# EAGLE design teensyAudioXbee_v11 (EAGLE 7.6.0)
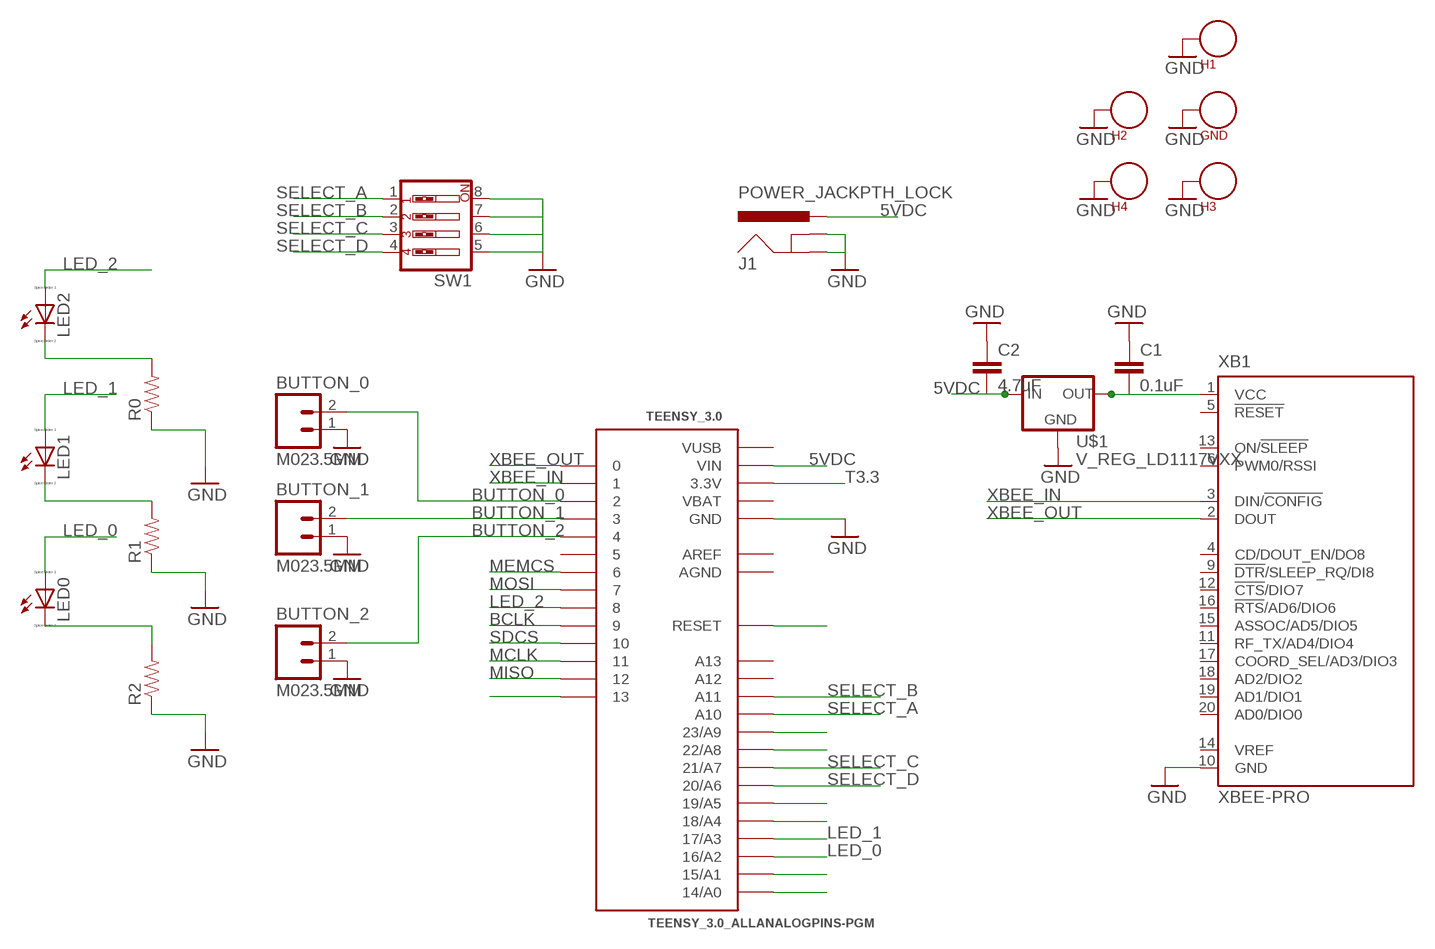
[diagram p0: schematic, sheet 1]

## Parts
BUTTON_0  M023.5MM  [SCREWTERMINAL-3.5MM-2]
BUTTON_1  M023.5MM  [SCREWTERMINAL-3.5MM-2]
BUTTON_2  M023.5MM  [SCREWTERMINAL-3.5MM-2]
C1  0.1uF  CAPEZ  [CAP-PTH-SMALLEZ]
C2  4.7uF  CAPEZ  [CAP-PTH-SMALLEZ]
GND  SEW_HOLE  [SIMPLE_HOLE]
H1  SEW_HOLE  [SIMPLE_HOLE]
H2  SEW_HOLE  [SIMPLE_HOLE]
H3  SEW_HOLE  [SIMPLE_HOLE]
H4  SEW_HOLE  [SIMPLE_HOLE]
J1  POWER_JACKPTH_LOCK  [POWER_JACK_PTH_LOCK]
LED0  LED_ELD260  [LED_LD260]
LED1  LED_ELD260  [LED_LD260]
LED2  LED_ELD260  [LED_LD260]
R0  RESISTORPTH-1/6W  [1/6W-RES]
R1  RESISTORPTH-1/6W  [1/6W-RES]
R2  RESISTORPTH-1/6W  [1/6W-RES]
SW1  SW_DIP-4  [EDG-04]
TEENSY_3.0  TEENSY_3.0_ALLANALOGPINS-PGM  [TEENSY_3.0_ALLANALOG-PGM]
U$1  V_REG_LD1117VXX  [78XXL]
XB1  XBEE-PRO  [XBEE-PRO]

## Nets
3.3VDC: C1.2 U$1.GND(OUT) XB1.1(VCC)
5VDC [5v]: C2.2 J1.PWR TEENSY_3.0.VIN U$1.OUT(IN)
BCLK: TEENSY_3.0.9
BUTTON_0: BUTTON_0.2 TEENSY_3.0.2
BUTTON_1: BUTTON_1.2 TEENSY_3.0.3
BUTTON_2: BUTTON_2.2 TEENSY_3.0.4
GND [gnd11]: BUTTON_0.1 BUTTON_1.1 BUTTON_2.1 C1.1 C2.1 GND.P$1 H1.P$1 H2.P$1 H3.P$1 H4.P$1 J1.GND J1.GNDBREAK R0.1 R1.1 R2.1 SW1.5 SW1.6 SW1.7 SW1.8 TEENSY_3.0.GND TEENSY_3.0.GND1(GND) TEENSY_3.0.GND2(GND) U$1.IN(GND) XB1.10(GND)
LED_0: LED0.A TEENSY_3.0.16/A2
LED_1: LED1.A TEENSY_3.0.17/A3
LED_2: LED2.A TEENSY_3.0.8
MCLK: TEENSY_3.0.11
MEMCS: TEENSY_3.0.6
MISO: TEENSY_3.0.12
MOSI: TEENSY_3.0.7
N$1: TEENSY_3.0.13
N$2: TEENSY_3.0.14/A0
N$3: TEENSY_3.0.15/A1
N$4: TEENSY_3.0.18/A4
N$5: TEENSY_3.0.19/A5
N$6: TEENSY_3.0.RST(RESET)
N$7: TEENSY_3.0.22/A8
N$8: TEENSY_3.0.23/A9
N$9: LED2.K(C) R0.2
N$10: LED1.K(C) R1.2
N$11: LED0.K(C) R2.2
SDCS: TEENSY_3.0.10
SELECT_A: SW1.1 TEENSY_3.0.A10
SELECT_B: SW1.2 TEENSY_3.0.A11
SELECT_C: SW1.3 TEENSY_3.0.21/A7
SELECT_D: SW1.4 TEENSY_3.0.20/A6
T3.3: TEENSY_3.0.3.3V TEENSY_3.0.3.3V1(3.3V) TEENSY_3.0.3.3V2(3.3V)
XBEE_IN: TEENSY_3.0.1 XB1.3(DIN/!CONFIG)
XBEE_OUT: TEENSY_3.0.0 XB1.2(DOUT)
Unconnected: TEENSY_3.0.5 TEENSY_3.0.A12 TEENSY_3.0.A13 XB1.4(CD/DOUT_EN/DO8) XB1.5(!RESET) XB1.6(PWM0/RSSI) XB1.9(!DTR!/SLEEP_RQ/DI8) XB1.11(RF_TX/AD4/DIO4) XB1.12(!CTS!/DIO7) XB1.13(ON/!SLEEP) XB1.14(VREF) XB1.15(ASSOC/AD5/DIO5) XB1.16(!RTS!/AD6/DIO6) XB1.17(COORD_SEL/AD3/DIO3) XB1.18(AD2/DIO2) XB1.19(AD1/DIO1) XB1.20(AD0/DIO0)

## Power pins joined to a net without a drawn wire
AGND: TEENSY_3.0.AGND
AREF: TEENSY_3.0.AREF
VBAT: TEENSY_3.0.VBAT
VUSB: TEENSY_3.0.VUSB

## Library data of the parts
BUTTON_0 BUTTON_1 BUTTON_2 = SparkFun-Connectors:M02: Standard 2-pin 0.1" header. Use with - straight break away headers ( PRT-00116) - right angle break away headers (PRT-00553) - swiss pins (PRT-00743) - machine pins (PRT-00117) - female headers (PRT-00115) Molex polarized connector foot print use with: PRT-08233 with associated crimp pins and housings. 2.54_SCREWTERM for use with PRT-10571. 3.5mm Screw Terminal footprints for PRT-08084 5mm Screw Terminal footprints for use with PRT-08433
C1 C2 = SparkFun-Capacitors:CAP: Capacitor Standard 0603 ceramic capacitor, and 0.1" leaded capacitor.
GND H1-H4 = LilyPad-Wearables:SEW_HOLE: Simple sew-hole .1" diameter hole with 20mil annular ring
J1 = SparkFun-Connectors:POWER_JACK: Power Jack This is the standard 5.5mm barrel jack for power. The PTH is the most common, proven, reliable, footprint. The Slot footprint only works if the mill layer is transmitted to the PCB fab house so be warned. Mating wall wart : TOL-00298 (and others); PROD_ID: CONN-08197; SF_ID: PRT-00119
LED0 LED1 LED2 = eagle-ltspice:LED_E: LED Source: http://www.osram.convergy.de Source: www.luxeon.com Source: www.kingbright.com; SPICEMODEL: NONE; SPICEPREFIX: D; SPICETYPE: diode
R0 R1 R2 = SparkFun-Passives:RESISTOR: Resistor Basic schematic elements and footprints for 0603, 1206, and PTH resistors.
SW1 = special:SW_DIP-4: DIP SWITCH
TEENSY_3.0 = Teensy3.0:TEENSY_3.0_ALLANALOGPINS-PGM: Teensy 3.0 outline with all Analog Input Pins and Pads enabled, PGM Pin is disabled. For more basic versions, see 'Basic' and '+4' while more pins are accessible in the 'AllPins' package. Requires the installation of a un-shrouded SMD header on the underside of the Teensy 3.0
U$1 = SparkFun-PowerIC:V_REG_LD1117VXX: LD1117VXX voltage regulator. We carry the 3.3V version (COM-00526) in TO-220 package.
XB1 = maxstream:XBEE: XBee (TM) /XBee-PRO(TM) OEM RF Modules Source: MaxStream, Inc. xbee_productmanual.pdf; MPN: XBP24-AWI-001; OC_FARNELL: 1337916; OC_NEWARK: 42M2667

## Net classes
0 default: width 0.051 mm
1 11v: width 1.27 mm
2 32v: width 1.27 mm
3 5v: width 0.635 mm
4 gnd11: width 0.635 mm

## Board
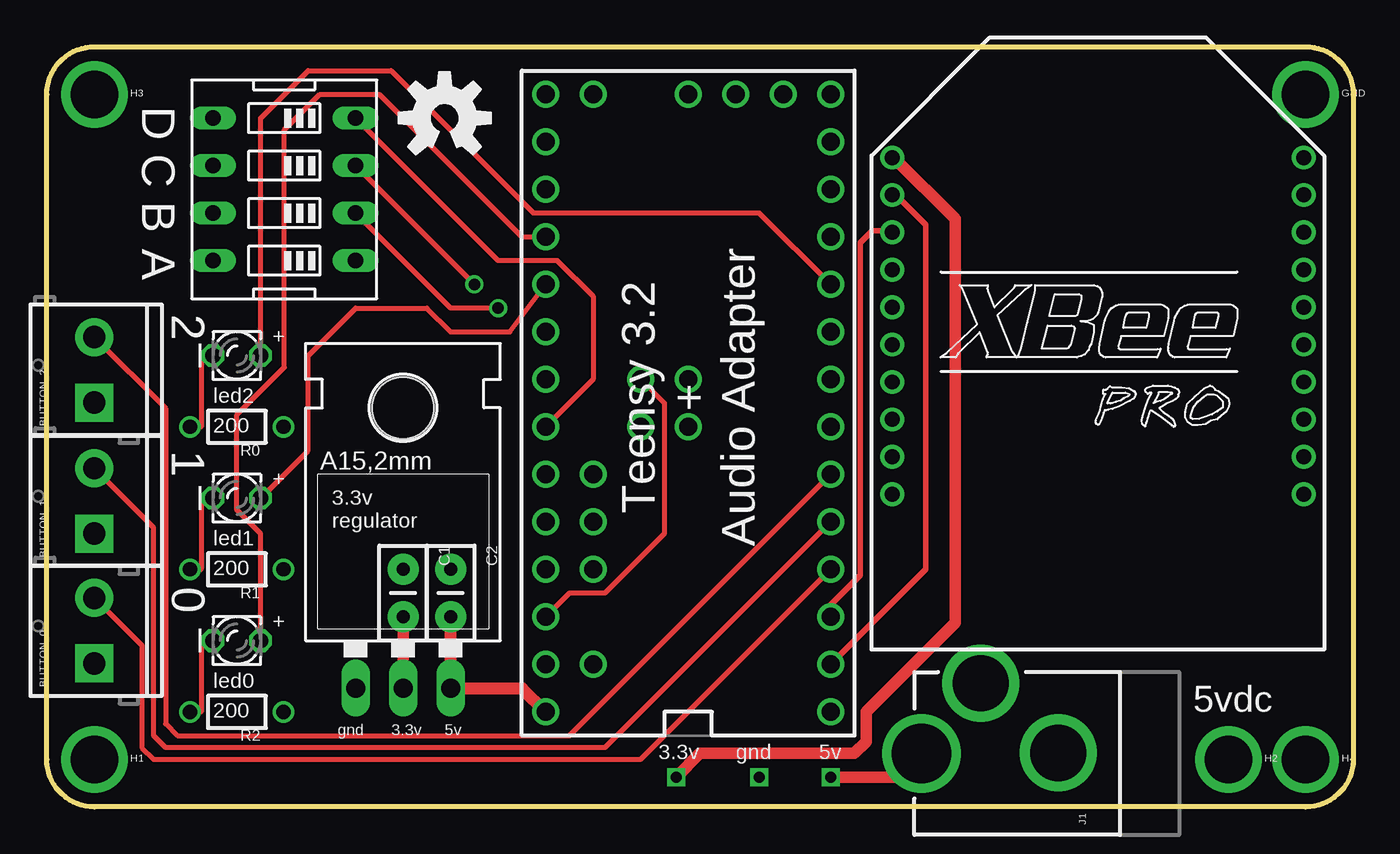
[diagram p1: board, top side]
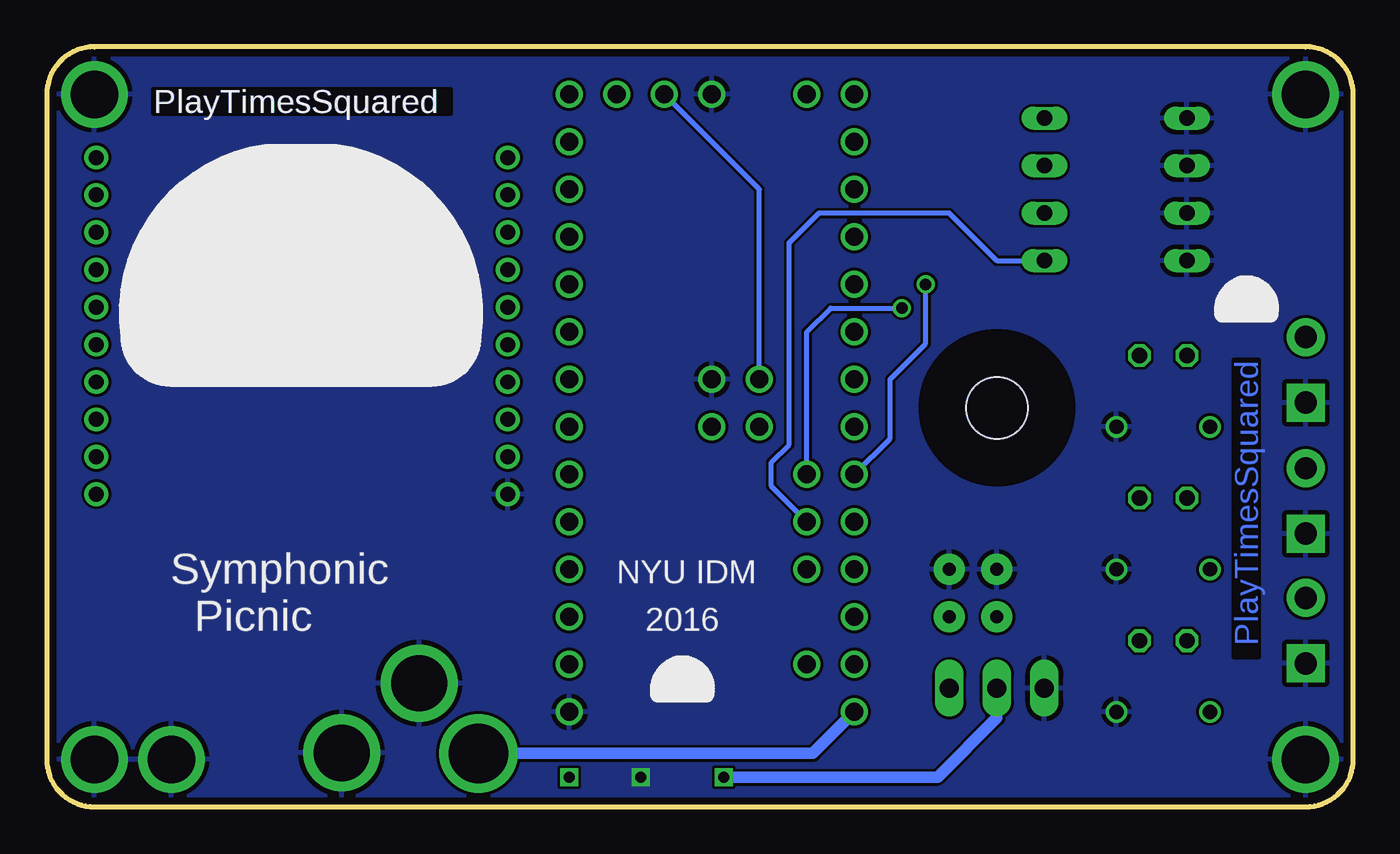
[diagram p2: board, bottom side, seen from below]

Size 69.85 x 40.64 mm. Coordinates in mm from the lower left corner, seen from the top.
Outline: 2.54,40.64 67.31,40.64 arc-90 69.85,38.1 69.85,2.54 arc-90 67.31,0 2.54,0 arc-90 0,2.54 0,38.1 arc-90 2.54,40.64
Copper layers (1*16): Top 0.0356mm / dielectric 1.5011mm / Bottom 0.0356mm
Design rules "LaenPCBOrder": minimum track width 6mil, minimum drill 13mil, track to track 6mil, track to pad 6mil, pad to pad 6mil, via to via 6mil, smd to smd 6mil, copper to edge 15mil, drill to drill 6mil, minimum pad ring 7mil, minimum via ring 7mil, stop-mask expansion 3mil, vias tented up to drill 0mil, thermal gap 10mil

### Footprints (pad centres in the part's own frame; a part is rotated, then mirrored left to right if it is on the bottom)
SCREWTERMINAL-3.5MM-2 = drill 1.2 pad 2.032 square: 1 0,0 | drill 1.2 pad 2.032: 2 3.5,0
CAP-PTH-SMALLEZ = drill 0.7 pad 1.651: 1 0,0; 2 2.54,0
SIMPLE_HOLE = drill 2.54 pad 3.048: P$1 0,0
POWER_JACK_PTH_LOCK = drill 2.997 pad 4.115: GND 0.025,6.557; GNDBREAK 3.762,10.7 | drill 3.2 pad 4.115: PWR 0,13.878
LED_LD260 = drill 0.813 octagon: A -1.27,0; K 1.27,0
1/6W-RES = drill 0.762: 1 -2.5,0; 2 2.5,0
EDG-04 = drill 0.813 long: 1 -3.81,-3.81; 2 -1.27,-3.81; 3 1.27,-3.81; 4 3.81,-3.81; 5 3.81,3.81; 6 1.27,3.81; 7 -1.27,3.81; 8 -3.81,3.81
TEENSY_3.0_ALLANALOG-PGM = drill 0.965: 0 -7.62,13.97; 1 -7.62,11.43; 2 -7.62,8.89; 3 -7.62,6.35; 3.3V 7.62,11.43; 3.3V1 -2.54,-16.51; 3.3V2 2.54,-1.27; 4 -7.62,3.81; 5 -7.62,1.27; 6 -7.62,-1.27; 7 -7.62,-3.81; 8 -7.62,-6.35; 9 -7.62,-8.89; 10 -7.62,-11.43; 11 -7.62,-13.97; 12 -7.62,-16.51; 13 7.62,-16.51; 14/A0 7.62,-13.97; 15/A1 7.62,-11.43; 16/A2 7.62,-8.89; 17/A3 7.62,-6.35; 18/A4 7.62,-3.81; 19/A5 7.62,-1.27; 20/A6 7.62,1.27; 21/A7 7.62,3.81; 22/A8 7.62,6.35; 23/A9 7.62,8.89; A10 5.08,6.35; A11 5.08,3.81; A12 0,1.27; A13 2.54,1.27; AGND 7.62,13.97; AREF 5.08,8.89; GND -7.62,16.51; GND1 0,-16.51; GND2 0,-1.27; RST 5.08,-16.51; VBAT -5.08,-16.51; VIN 7.62,16.51; VUSB 5.08,13.97
78XXL = drill 1.016 long: GND 0,-3.81; IN -2.54,-3.81; OUT 2.54,-3.81 | hole 3.302: 0,11.176
XBEE-PRO = drill 0.8 pad 1.27: 1 -11,9; 2 -11,7; 3 -11,5; 4 -11,3; 5 -11,1; 6 -11,-1; 7 -11,-3; 8 -11,-5; 9 -11,-7; 10 -11,-9; 11 11,-9; 12 11,-7; 13 11,-5; 14 11,-3; 15 11,-1; 16 11,1; 17 11,3; 18 11,5; 19 11,7; 20 11,9

### Placement (x,y rotation side)
BUTTON_0  2.54,7.67 90 top
BUTTON_1  2.54,14.61 90 top
BUTTON_2  2.54,21.62 90 top
C1  19.05,12.7 270 top
C2  21.59,12.7 270 top
GND  67.31,38.1 0 top
H1  2.54,2.54 0 top
H2  63.18,2.54 0 top
H3  2.54,38.1 0 top
H4  67.31,2.54 0 top
J1  60.64,2.86 90 top
LED0  10.16,8.89 180 top
LED1  10.16,16.51 180 top
LED2  10.16,24.13 180 top
R0  10.16,20.32 180 top
R1  10.16,12.7 180 top
R2  10.16,5.08 180 top
SW1  12.7,33.02 90 top
TEENSY_3.0  34.29,21.59 180 top
U$1  19.05,10.16 0 top
U$2  [OSHW-LOGO-M]  21.27,36.83 0 top
XB1  56.2,25.72 0 top

### Tracks (layer width: path | path; a pad name or v marks a point on that pad's centre or on a via)
3.3VDC  (via drill 0.6)
  Top 0.61: C1.2 U$1.GND | XB1.1 45.29,34.72 48.58,31.43 48.58,9.84 43.82,5.08 43.82,3.49 43.18,2.86 34.93,2.86 v33.66,1.59
  Bottom 0.61: v33.66,1.59 22.23,1.59 19.05,4.76 U$1.GND
5VDC  (via drill 0.6)
  Top 0.61: v41.91,1.59 45.5,1.59 J1.PWR
  Top 0.635: TEENSY_3.0.VIN 25.4,6.35 U$1.OUT C2.2
  Bottom 0.61: J1.PWR 28.89,2.86 TEENSY_3.0.VIN
BUTTON_0
  Top 0.254: BUTTON_0.2 5.08,8.63 5.08,3.17 5.71,2.54 31.75,2.54 TEENSY_3.0.2
BUTTON_1
  Top 0.254: TEENSY_3.0.3 29.84,3.17 6.35,3.17 5.71,3.81 5.71,14.93 BUTTON_1.2
BUTTON_2
  Top 0.254: BUTTON_2.2 6.35,21.3 6.35,4.45 6.98,3.81 27.94,3.81 TEENSY_3.0.4
GND  (via drill 0.6)
  other vias: 38.1,1.59
  pour Bottom: 0,40.01 69.85,40.01 69.85,0 0,0
LED_0
  Top 0.254: LED0.A 11.43,14.61 10.16,15.88 10.16,20.95 12.7,23.5 12.7,36.2 14.6,38.1 17.78,38.1 25.4,30.48 TEENSY_3.0.16/A2
LED_1
  Top 0.254: LED1.A 13.97,19.05 13.97,24.13 16.51,26.67 20.32,26.67 21.59,25.4 24.77,25.4 TEENSY_3.0.17/A3
LED_2
  Top 0.254: TEENSY_3.0.8 38.1,31.75 26.03,31.75 18.41,39.37 13.97,39.37 11.43,36.83 LED2.A
N$9
  Top 0.254: LED2.K 8.26,24.13 8.26,20.32 R0.2
N$10
  Top 0.254: LED1.K 8.26,16.51 8.26,12.7 R1.2
N$11
  Top 0.254: LED0.K 8.26,8.89 8.26,5.08 R2.2
SELECT_A
  Bottom 0.254: SW1.1 19.05,29.21 21.59,31.75 28.58,31.75 30.16,30.16 30.16,19.37 31.12,18.41 31.12,17.14 TEENSY_3.0.A10
SELECT_B  (via drill 0.61)
  Top 0.254: SW1.2 21.59,26.67 v24.13,26.67
  Bottom 0.254: v24.13,26.67 27.94,26.67 29.21,25.4 TEENSY_3.0.A11
SELECT_C  (via drill 0.61)
  Top 0.254: v22.86,27.94 SW1.3
  Bottom 0.254: v22.86,27.94 22.86,24.77 24.77,22.86 24.77,19.68 TEENSY_3.0.21/A7
SELECT_D
  Top 0.254: SW1.4 24.13,29.21 27.3,29.21 29.21,27.3 29.21,22.86 TEENSY_3.0.20/A6
T3.3
  Top 0.254: TEENSY_3.0.3.3V 27.94,11.43 29.84,11.43 33.02,14.61 33.02,21.59 TEENSY_3.0.3.3V2
  Bottom 0.254: TEENSY_3.0.3.3V1 31.75,33.02 TEENSY_3.0.3.3V2
XBEE_IN
  Top 0.305: TEENSY_3.0.1 41.91,10.79 43.5,12.38 43.5,30.16 44.13,30.8 45.12,30.8 XB1.3
XBEE_OUT
  Top 0.305: XB1.2 45.39,32.72 46.99,31.11 46.99,12.7 TEENSY_3.0.0

### Text on the board
Bottom: PlayTimesSquared | PlayTimesSquared
tPlace: D | C | B | A | 2 | + | led2 | Teensy 3.2 / + / Audio Adapter | 200 | 1 | + | 3.3v / regulator | led1 | 0 | 200 | + | led0 | 200 | 5vdc | gnd | 3.3v | 5v | 3.3v | gnd | 5v
bPlace: PlayTimesSquared | NYU IDM | 2016 | Symphonic / Picnic
tOrigins: gnd
bStop: PlayTimesSquared | ShroomCity